# EAGLE design servo (EAGLE 9.6.2)
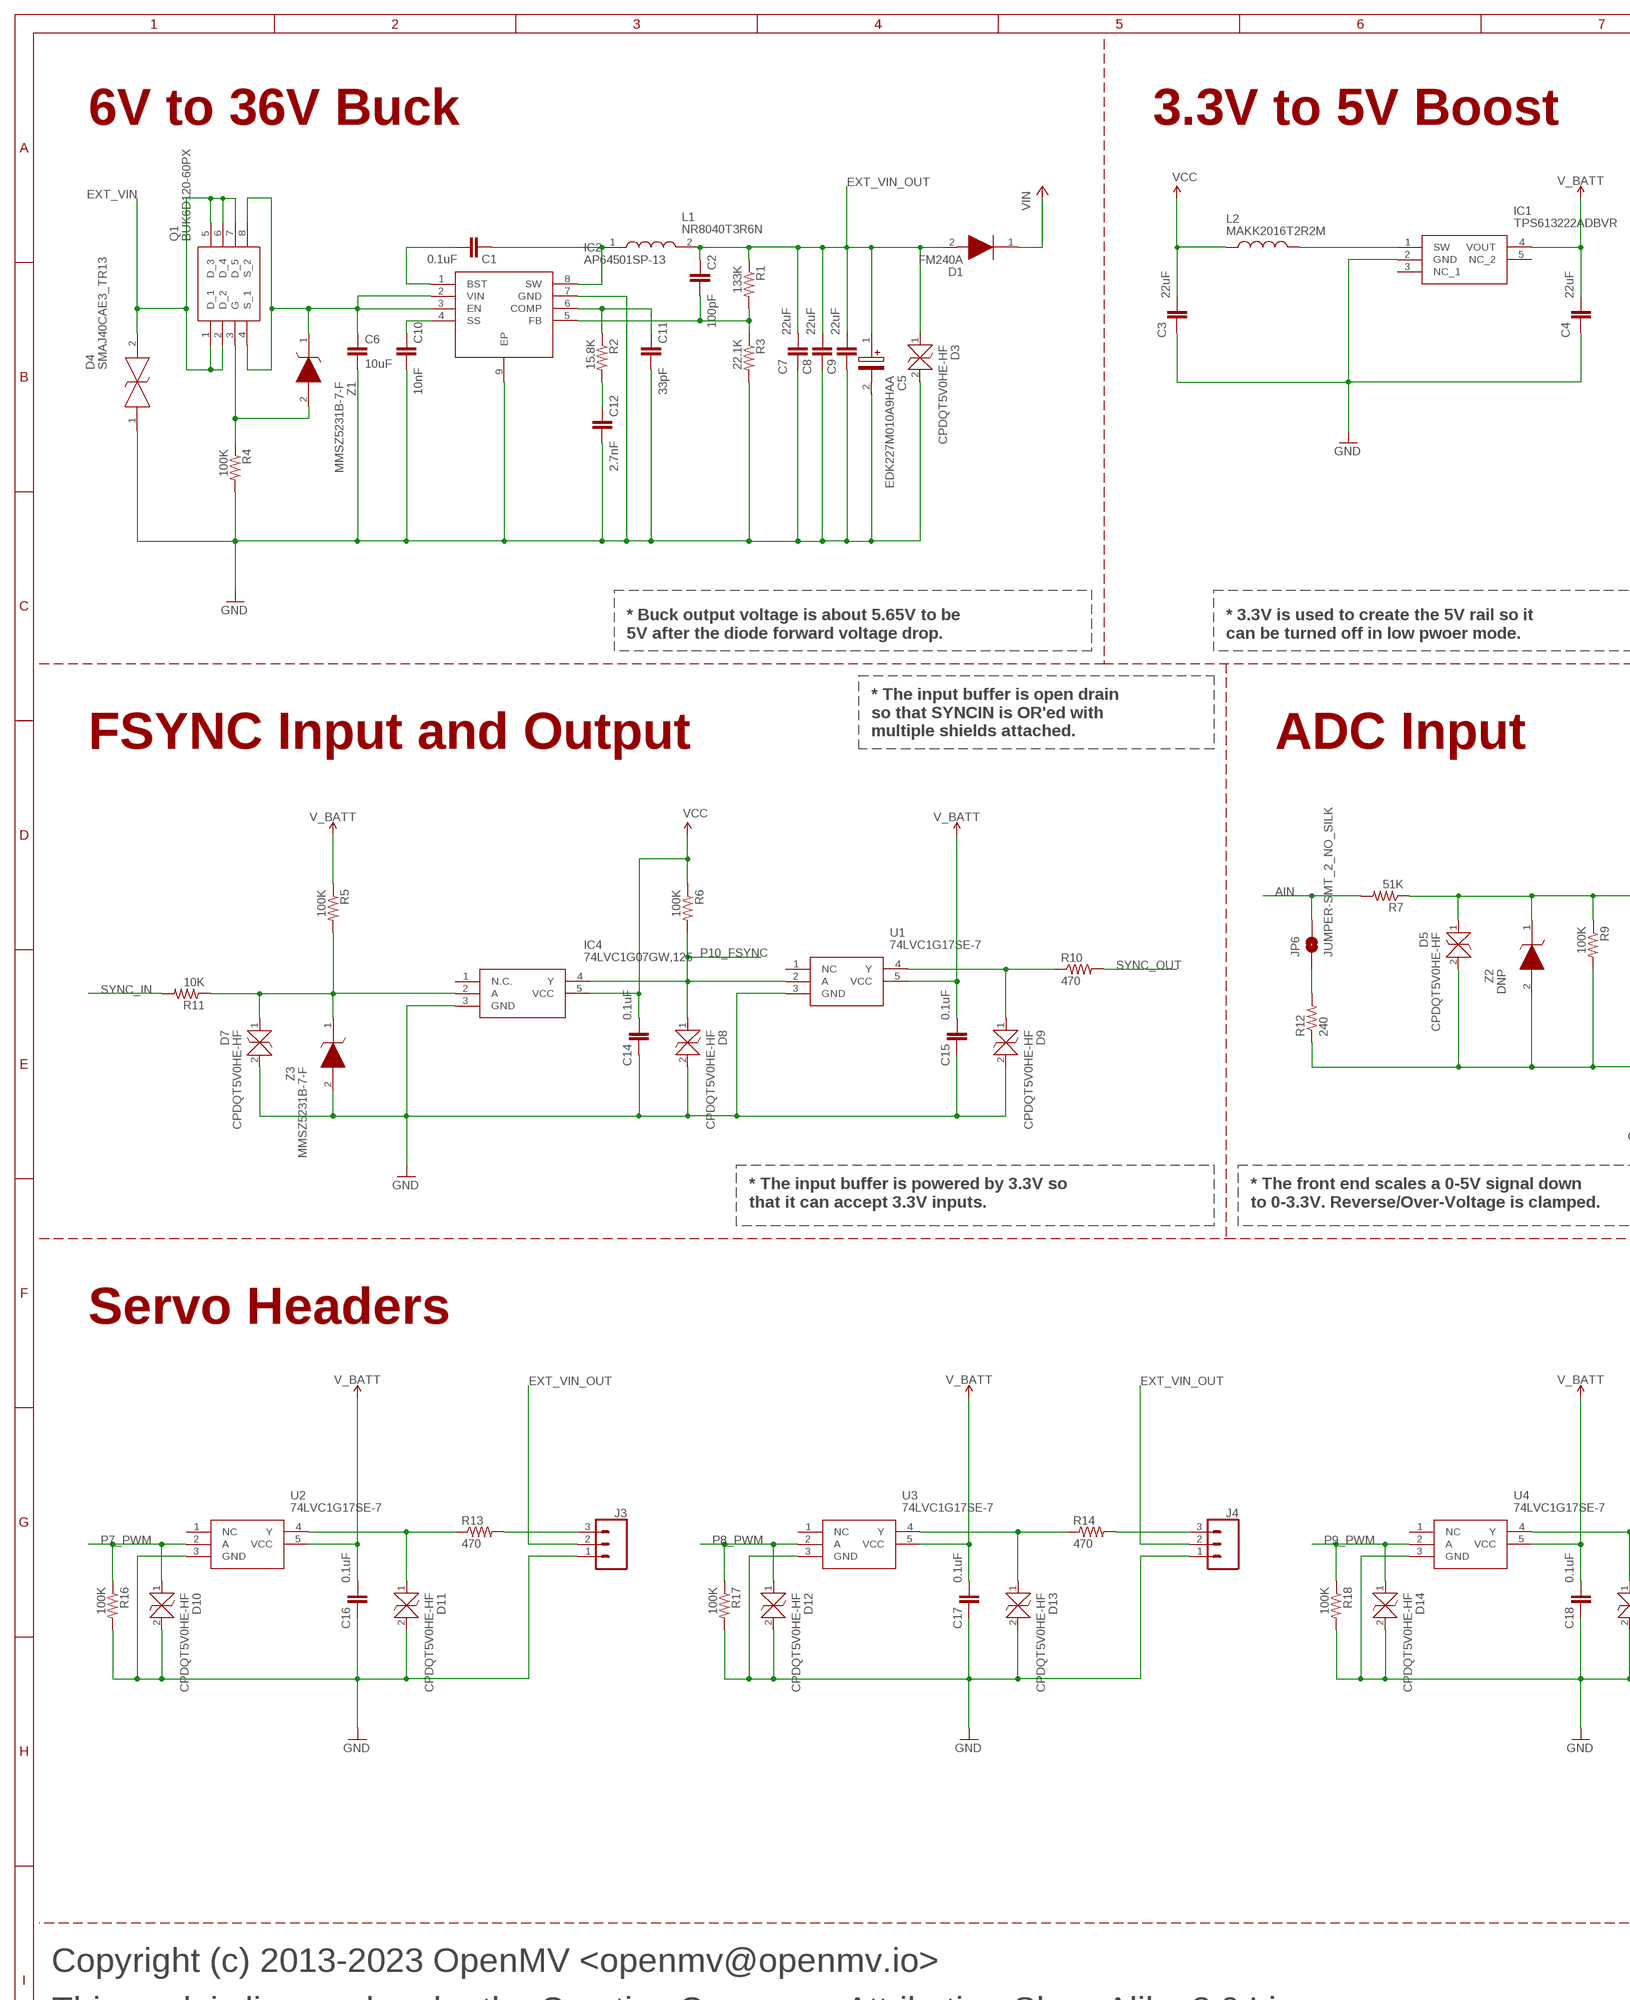
[diagram p0: schematic, sheet 1, part 1 of 2]
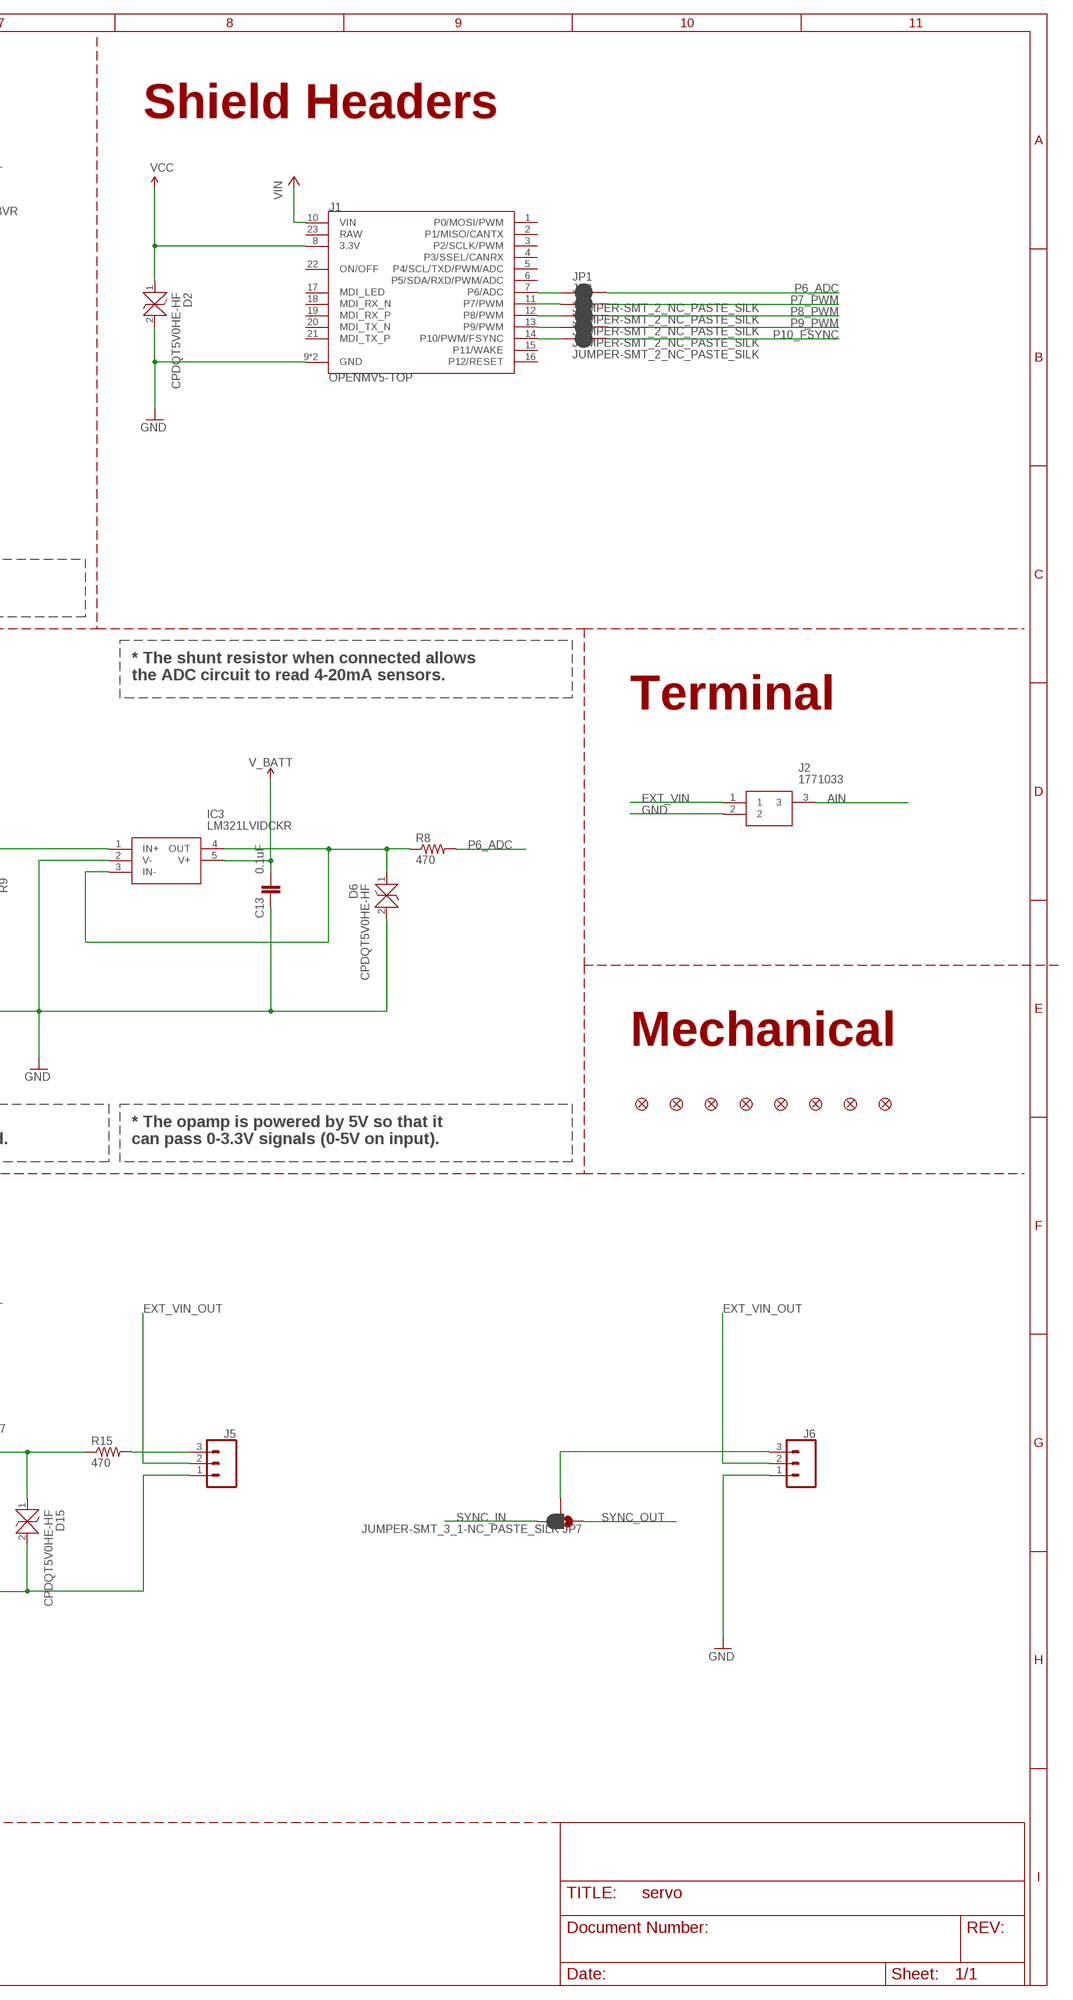
[diagram p1: schematic, sheet 1, part 2 of 2]

## Parts
C1  0.1uF  CAP_0402  [0402]
C2  100pF  CAP_0402  [0402]
C3  22uF  22UF-0805-6.3V-20%  [0805]
C4  22uF  22UF-0805-6.3V-20%  [0805]
C5  EDK227M010A9HAA  [CAPAE660X800N]
C6  10uF  C-EUC0805  [C0805]
C7  22uF  22UF-0805-6.3V-20%  [0805]
C8  22uF  22UF-0805-6.3V-20%  [0805]
C9  22uF  22UF-0805-6.3V-20%  [0805]
C10  10nF  CAP_0402  [0402]
C11  33pF  CAP_0402  [0402]
C12  2.7nF  CAP_0402  [0402]
C13  0.1uF  CAP_0402  [0402]
C14  0.1uF  CAP_0402  [0402]
C15  0.1uF  CAP_0402  [0402]
C16  0.1uF  CAP_0402  [0402]
C17  0.1uF  CAP_0402  [0402]
C18  0.1uF  CAP_0402  [0402]
D1  FM240A  [DIOM5025X231N]
D2  CPDQT5V0HE-HF  [CPDQT5V0HEHF]
D3  CPDQT5V0HE-HF  [CPDQT5V0HEHF]
D4  SMAJ40CAE3_TR13  [SMAJ40CAE3TR13]
D5  CPDQT5V0HE-HF  [CPDQT5V0HEHF]
D6  CPDQT5V0HE-HF  [CPDQT5V0HEHF]
D7  CPDQT5V0HE-HF  [CPDQT5V0HEHF]
D8  CPDQT5V0HE-HF  [CPDQT5V0HEHF]
D9  CPDQT5V0HE-HF  [CPDQT5V0HEHF]
D10  CPDQT5V0HE-HF  [CPDQT5V0HEHF]
D11  CPDQT5V0HE-HF  [CPDQT5V0HEHF]
D12  CPDQT5V0HE-HF  [CPDQT5V0HEHF]
D13  CPDQT5V0HE-HF  [CPDQT5V0HEHF]
D14  CPDQT5V0HE-HF  [CPDQT5V0HEHF]
D15  CPDQT5V0HE-HF  [CPDQT5V0HEHF]
FD1  FIDUCIAL1X2  [FIDUCIAL-1X2]
FD2  FIDUCIAL1X2  [FIDUCIAL-1X2]
FD3  FIDUCIAL1X2  [FIDUCIAL-1X2]
FD4  FIDUCIAL1X2  [FIDUCIAL-1X2]
FD5  FIDUCIAL1X2  [FIDUCIAL-1X2]
FD6  FIDUCIAL1X2  [FIDUCIAL-1X2]
FD7  FIDUCIAL1X2  [FIDUCIAL-1X2]
FD8  FIDUCIAL1X2  [FIDUCIAL-1X2]
IC1  TPS613222ADBVR  [SOT95P280X145-5N]
IC2  AP64501SP-13  [SOIC127P600X163-9N]
IC3  LM321LVIDCKR  [SOT65P210X110-5N]
IC4  74LVC1G07GW,125  [SOT65P212X110-5N]
J1  OPENMV5-TOP  [OPENMV5-TOP]
J2  1771033  [1771033]
J3  CONN_03  [1X03]
J4  CONN_03  [1X03]
J5  CONN_03  [1X03]
J6  CONN_03  [1X03]
JP1  JUMPER-SMT_2_NC_PASTE_SILK  [SMT-JUMPER_2_NC_PASTE_SILK]
JP2  JUMPER-SMT_2_NC_PASTE_SILK  [SMT-JUMPER_2_NC_PASTE_SILK]
JP3  JUMPER-SMT_2_NC_PASTE_SILK  [SMT-JUMPER_2_NC_PASTE_SILK]
JP4  JUMPER-SMT_2_NC_PASTE_SILK  [SMT-JUMPER_2_NC_PASTE_SILK]
JP5  JUMPER-SMT_2_NC_PASTE_SILK  [SMT-JUMPER_2_NC_PASTE_SILK]
JP6  JUMPER-SMT_2_NO_SILK  [SMT-JUMPER_2_NO_SILK]
JP7  JUMPER-SMT_3_1-NC_PASTE_SILK  [SMT-JUMPER_3_1-NC_PASTE_SILK]
L1  NR8040T3R6N  [NR8040T3R6N]
L2  MAKK2016T2R2M  [INDC2016X100N]
Q1  BUK6D120-60PX  [BUK6D12060PX]
R1  133K  RES_0402  [0402]
R2  15.8K  RES_0402  [0402]
R3  22.1K  RES_0402  [0402]
R4  100K  RES_0402  [0402]
R5  100K  RES_0402  [0402]
R6  100K  RES_0402  [0402]
R7  51K  RES_0402  [0402]
R8  470  R-US_R0603  [R0603]
R9  100K  RES_0402  [0402]
R10  470  R-US_R0603  [R0603]
R11  10K  RES_0402  [0402]
R12  240  R-US_R0603  [R0603]
R13  470  R-US_R0603  [R0603]
R14  470  R-US_R0603  [R0603]
R15  470  R-US_R0603  [R0603]
R16  100K  RES_0402  [0402]
R17  100K  RES_0402  [0402]
R18  100K  RES_0402  [0402]
U1  74LVC1G17SE-7  [SOT65P210X110-5N]
U2  74LVC1G17SE-7  [SOT65P210X110-5N]
U3  74LVC1G17SE-7  [SOT65P210X110-5N]
U4  74LVC1G17SE-7  [SOT65P210X110-5N]
Z1  MMSZ5231B-7-F  [SOD3716X145N]
Z2  DNP  MM3Z3V6T1G  [SOD2512X110N]
Z3  MMSZ5231B-7-F  [SOD3716X145N]

## Nets
AIN [signal]: J2.3 JP6.2 R7.2
AIN_INT [signal]: D5.1 IC3.1(IN+) R7.1 R9.1 Z2.1(K)
AIN_OUT [signal]: D6.1 IC3.3(IN-) IC3.4(OUT) R8.1
AIN_S [signal]: JP6.1 R12.2
EXT_VIN [hipwr]: D4.2 J2.1 Q1.1(D_1) Q1.2(D_2) Q1.5(D_3) Q1.6(D_4) Q1.7(D_5)
EXT_VIN_BST [hipwr]: C1.2 IC2.1(BST)
EXT_VIN_COMP [hipwr]: C11.1 IC2.6(COMP) R2.1
EXT_VIN_COMP_CAP [hipwr]: C12.1 R2.2
EXT_VIN_FB [hipwr]: C2.2 IC2.5(FB) R1.2 R3.1
EXT_VIN_G [hipwr]: Q1.3(G) R4.1 Z1.2(A)
EXT_VIN_INT [hipwr]: C6.1 IC2.2(VIN) IC2.3(EN) Q1.4(S_1) Q1.8(S_2) Z1.1(K)
EXT_VIN_OUT [hipwr]: C2.1 C5.1(+) C7.2 C8.2 C9.2 D1.2(A) D3.1 J3.2 J4.2 J5.2 J6.2 L1.2 R1.1
EXT_VIN_SS [hipwr]: C10.1 IC2.4(SS)
EXT_VIN_SW [hipwr]: C1.1 IC2.8(SW) L1.1
GND [gnd]: C3.1 C4.1 C5.2(-) C6.2 C7.1 C8.1 C9.1 C10.2 C11.2 C12.2 C13.1 C14.1 C15.1 C16.1 C17.1 C18.1 D2.2 D3.2 D4.1 D5.2 D6.2 D7.2 D8.2 D9.2 D10.2 D11.2 D12.2 D13.2 D14.2 D15.2 IC1.2(GND) IC2.7(GND) IC2.9(EP) IC3.2(V-) IC4.3(GND) J1.9(GND) J1.24(GND) J2.2 J3.1 J4.1 J5.1 J6.1 R3.2 R4.2 R9.2 R12.1 R16.2 R17.2 R18.2 U1.3(GND) U2.3(GND) U3.3(GND) U4.3(GND) Z2.2(A) Z3.2(A)
P6_ADC [signal]: JP1.2 R8.2
P6_ADC_INT [signal]: J1.7(P6/ADC) JP1.1
P7_PWM [signal]: D10.1 JP2.2 R16.1 U2.2(A)
P7_PWM_INT [signal]: J1.11(P7/PWM) JP2.1
P7_PWM_SERVO [signal]: J3.3 R13.2
P7_PWM_SERVO_INT [signal]: D11.1 R13.1 U2.4(Y)
P8_PWM [signal]: D12.1 JP3.2 R17.1 U3.2(A)
P8_PWM_INT [signal]: J1.12(P8/PWM) JP3.1
P8_PWM_SERVO [signal]: J4.3 R14.2
P8_PWM_SERVO_INT [signal]: D13.1 R14.1 U3.4(Y)
P9_PWM [signal]: D14.1 JP4.2 R18.1 U4.2(A)
P9_PWM_INT [signal]: J1.13(P9/PWM) JP4.1
P9_PWM_SERVO [signal]: J5.3 R15.2
P9_PWM_SERVO_INT [signal]: D15.1 R15.1 U4.4(Y)
P10_FSYNC [signal]: D8.1 IC4.4(Y) JP5.2 R6.2 U1.2(A)
P10_FSYNC_INT [signal]: J1.14(P10/PWM/FSYNC) JP5.1
SW [hipwr]: IC1.1(SW) L2.2
SYNC [signal]: J6.3 JP7.2
SYNC_IN [signal]: JP7.3 R11.2
SYNC_IN_INT [signal]: D7.1 IC4.2(A) R5.2 R11.1 Z3.1(K)
SYNC_OUT [signal]: JP7.1 R10.2
SYNC_OUT_INT [signal]: D9.1 R10.1 U1.4(Y)
V_BATT [pwr]: C4.2 C13.2 C15.2 C16.2 C17.2 C18.2 IC1.4(VOUT) IC3.5(V+) R5.1 U1.5(VCC) U2.5(VCC) U3.5(VCC) U4.5(VCC)
VCC [pwr]: C3.2 C14.2 D2.1 IC4.5(VCC) J1.8(3.3V) L2.1 R6.1
VIN [hipwr]: D1.1(K) J1.10(VIN)
Unconnected: IC1.3(NC_1) IC1.5(NC_2) IC4.1(N.C.) J1.1(P0/MOSI/PWM) J1.2(P1/MISO/CANTX) J1.3(P2/SCLK/PWM) J1.4(P3/SSEL/CANRX) J1.5(P4/SCL/TXD/PWM/ADC) J1.6(P5/SDA/RXD/PWM/ADC) J1.15(P11/WAKE) J1.16(P12/RESET) J1.17(MDI_LED) J1.18(MDI_RX_N) J1.19(MDI_RX_P) J1.20(MDI_TX_N) J1.21(MDI_TX_P) J1.22(ON/OFF) J1.23(RAW) U1.1(NC) U2.1(NC) U3.1(NC) U4.1(NC)

## Notes on the sheet
- 6V to 36V Buck | 3.3V to 5V Boost | Shield Headers
- * Buck output voltage is about 5.65V to be
  5V after the diode forward voltage drop.
- * 3.3V is used to create the 5V rail so it
  can be turned off in low pwoer mode.
- * The shunt resistor when connected allows
  the ADC circuit to read 4-20mA sensors.
- * The input buffer is open drain
  so that SYNCIN is OR'ed with
  multiple shields attached.
- FSYNC Input and Output | ADC Input | Terminal
- Mechanical
- * The input buffer is powered by 3.3V so
  that it can accept 3.3V inputs.
- * The front end scales a 0-5V signal down
  to 0-3.3V. Reverse/Over-Voltage is clamped.
- * The opamp is powered by 5V so that it
  can pass 0-3.3V signals (0-5V on input).
- Servo Headers
- Copyright (c) 2013-2023 OpenMV <openmv@openmv.io>
- This work is licensed under the Creative Commons Attribution-ShareAlike 3.0 License.
- To view a copy of this license, visit http://creativecommons.org/licenses/by-sa/3.0/

## Library data of the parts
C1 C13-C18 = 0402:CAP_0402: 0402 (1005 Metric) Nick Garner - TeleSense; MPN: GRM155R71H104KE14D
C2 = 0402:CAP_0402: 0402 (1005 Metric) Nick Garner - TeleSense; MPN: CC0402JRNPO9BN101
C3 C4 C7-C9 = SparkFun-Capacitors:22UF: 22µF ceramic capacitors A capacitor is a passive two-terminal electrical component used to store electrical energy temporarily in an electric field.; MPN: CL21A226MQQNNNE; PROD_ID: CAP-08402
C5 = EDK227M010A9HAA:EDK227M010A9HAA: EDK, Aluminum, Aluminum Electrolytic, 220 uF, 20%, 10 VDC, -40/+85C, 85C, -40C, 85C, 2,000 Hrs, 26 % , 0.25, 22 uA, 3, 6, 6.3mm, 7.7mm, 1000 Source: Datasheet <https://content.kemet.com/datasheets/KEM_A4001_EDK.pdf>; DESCRIPTION: EDK, Aluminum, Aluminum Electrolytic, 220 uF, 20%, 10 VDC, -40/+85C, 85C, -40C, 85C, 2,000 Hrs, 26 % , 0.25, 22 uA, 3, 6, 6.3mm, 7.7mm, 1000; HEIGHT: 8mm; MANUFACTURER_NAME: KEMET; MANUFACTURER_PART_NUMBER: EDK227M010A9HAA; MOUSER_PART_NUMBER: 80-EDK227M010A9HAA; MOUSER_PRICE-STOCK: https://www.mouser.co.uk/ProductDetail/KEMET/EDK227M010A9HAA?qs=E9QF1UCAUX64XuBtcKp6BA%3D%3D; MPN: EDK227M010A9HAA
C6 = rcl:C-EU: CAPACITOR, European symbol; MPN: GRM21BR61H106KE43K; SPICEPREFIX: C
C10 = 0402:CAP_0402: 0402 (1005 Metric) Nick Garner - TeleSense; MPN: CL05B103KB5NNNC
C11 = 0402:CAP_0402: 0402 (1005 Metric) Nick Garner - TeleSense; MPN: 04025A330JAT2A
C12 = 0402:CAP_0402: 0402 (1005 Metric) Nick Garner - TeleSense; MPN: GCM155R71H272KA37J
D1 = FM240A:FM240A: Diodes - General Purpose, Power, Switching GP Si Rectifier SMB,2A,40V Source: Datasheet <https://ms.componentsearchengine.com/Datasheets/1/FM240A.pdf>; DESCRIPTION: Diodes - General Purpose, Power, Switching GP Si Rectifier SMB,2A,40V; HEIGHT: 2.31mm; MANUFACTURER_NAME: Rectron; MANUFACTURER_PART_NUMBER: FM240A; MOUSER_PART_NUMBER: 583-FM240A; MOUSER_PRICE-STOCK: https://www.mouser.co.uk/ProductDetail/Rectron/FM240A?qs=7pEAo90IqNG7sknZwmLYhQ%3D%3D; MPN: FM240A
D2 D3 D5-D15 = CPDQT5V0HE-HF:CPDQT5V0HE-HF: ESD Suppressors / TVS Diodes DIODE ESD 5VWM 65W 0402/SOD-923F Source: Datasheet <https://www.comchiptech.com/admin/files/product/CPDQT5V0HE-HF RevA.PDF>; DESCRIPTION: ESD Suppressors / TVS Diodes DIODE ESD 5VWM 65W 0402/SOD-923F; HEIGHT: 0.42mm; MANUFACTURER_NAME: Comchip Technology; MANUFACTURER_PART_NUMBER: CPDQT5V0HE-HF; MPN: CPDQT5V0HE-HF
D4 = SMAJ40CAe3_TR13:SMAJ40CAE3_TR13: ESD Suppressors / TVS Diodes TVS Source: Datasheet <https://www.arrow.com/en/products/smaj40cae3tr13/microchip-technology?region=nac>; DESCRIPTION: ESD Suppressors / TVS Diodes TVS; HEIGHT: 3.05mm; MANUFACTURER_NAME: Microchip; MANUFACTURER_PART_NUMBER: SMAJ40CAe3/TR13; MOUSER_PART_NUMBER: 494-SMAJ40CAE3/TR13; MOUSER_PRICE-STOCK: https://www.mouser.co.uk/ProductDetail/Microchip-Technology/SMAJ40CAe3-TR13?qs=pU29NIZ4ZwCw3PnlxOleOw%3D%3D; MPN: SMAJ40CAe3/TR13
FD1-FD8 = SparkFun-Aesthetics:FIDUCIAL: Fiducial Alignment Points Point-of-reference for pick-and-place machines and other optical instruments.
IC1 = TPS613222ADBVR:TPS613222ADBVR: 6-uA Quiescent Current, 1.8-A Switch Current Boost Converter Source: Datasheet <http://www.ti.com/lit/gpn/tps61322>; DESCRIPTION: 6-uA Quiescent Current, 1.8-A Switch Current Boost Converter; HEIGHT: 1.45mm; MANUFACTURER_NAME: Texas Instruments; MANUFACTURER_PART_NUMBER: TPS613222ADBVR; MOUSER_PART_NUMBER: 595-TPS613222ADBVR; MOUSER_PRICE-STOCK: https://www.mouser.co.uk/ProductDetail/Texas-Instruments/TPS613222ADBVR?qs=W0yvOO0ixfE4d69WXsn8NQ%3D%3D; MPN: TPS613222ADBVR
IC2 = AP64501SP-13:AP64501SP-13: Conv DC-DC 3.8V to 40V Synchronous Step Down Single-Out 0.8V to 39V 5A 8-Pin SO EP T/R Source: Datasheet <https://www.arrow.com/en/products/ap64501sp-13/diodes-incorporated>; DESCRIPTION: Conv DC-DC 3.8V to 40V Synchronous Step Down Single-Out 0.8V to 39V 5A 8-Pin SO EP T/R; HEIGHT: 1.63mm; MANUFACTURER_NAME: Diodes Inc.; MANUFACTURER_PART_NUMBER: AP64501SP-13; MOUSER_PART_NUMBER: 621-AP64501SP-13; MOUSER_PRICE-STOCK: https://www.mouser.co.uk/ProductDetail/Diodes-Incorporated/AP64501SP-13?qs=P1JMDcb91o7FS0GU%252BW7TIQ%3D%3D; MPN: AP64501SP-13
IC3 = LM321LVIDCKR:LM321LVIDCKR: 1-Channel industry standard low voltage operational amplifier Source: Datasheet <http://www.ti.com/lit/gpn/LM321LV>; DESCRIPTION: 1-Channel industry standard low voltage operational amplifier; HEIGHT: 1.1mm; MANUFACTURER_NAME: Texas Instruments; MANUFACTURER_PART_NUMBER: LM321LVIDCKR; MOUSER_PART_NUMBER: 595-LM321LVIDCKR; MOUSER_PRICE-STOCK: https://www.mouser.co.uk/ProductDetail/Texas-Instruments/LM321LVIDCKR?qs=qSfuJ%252Bfl%2Fd6RcyTOjkRx5Q%3D%3D; MPN: LM321LVIDCKR
IC4 = 74LVC1G07GW_125:74LVC1G07GW,125: 74LVC1G07 - Buffer with open-drain output@en-us Source: Datasheet <https://assets.nexperia.com/documents/data-sheet/74LVC1G07.pdf>; DESCRIPTION: 74LVC1G07 - Buffer with open-drain output@en-us; HEIGHT: 1.1mm; MANUFACTURER_NAME: Nexperia; MANUFACTURER_PART_NUMBER: 74LVC1G07GW,125; MOUSER_PART_NUMBER: 771-74LVC1G07GW-G; MOUSER_PRICE-STOCK: https://www.mouser.co.uk/ProductDetail/Nexperia/74LVC1G07GW125?qs=me8TqzrmIYW763Mg%2FG86Uw%3D%3D; MPN: 74LVC1G07GW,125
J1 = openmv5:OPENMV5-TOP
J2 = 1771033:1771033: PCB terminal block, nominal current: 6 A, rated voltage (III/2): 160 V, nominal cross section: 0.5 mm?, Number of potentials: 3, Number of rows: 1, Number of positions per row: 3, product range: PTSM 0,5/..-H-SMD, pitch: 2.5 mm, connection method: Push-in spring connection, mounting: SMD soldering, conductor/PCB connection direction: 0 ?, color: black, Pin layout: Linear pad geometry, type of packaging: packed in cardboard Source: Datasheet <http://www.phoenixcontact.com/de/produkte/1771033/pdf>; ARROW_PART_NUMBER: 1771033; ARROW_PRICE-STOCK: https://www.arrow.com/en/products/1771033/phoenix-contact?region=nac; DESCRIPTION: PCB terminal block, nominal current: 6 A, rated voltage (III/2): 160 V, nominal cross section: 0.5 mm?, Number of potentials: 3, Number of rows: 1, Number of positions per row: 3, product range: PTSM 0,5/..-H-SMD, pitch: 2.5 mm, connection method: Push-in spring connection, mounting: SMD soldering, conductor/PCB connection direction: 0 ?, color: black, Pin layout: Linear pad geometry, type of packaging: packed in cardboard; HEIGHT: 5.22mm; MANUFACTURER_NAME: Phoenix Contact; MANUFACTURER_PART_NUMBER: 1771033; MOUSER_PART_NUMBER: 651-1771033; MOUSER_PRICE-STOCK: https://www.mouser.co.uk/ProductDetail/Phoenix-Contact/1771033?qs=Q77YN%2FRrsKK5q5FqaCIZZA%3D%3D; MPN: 1771033
J3-J6 = SparkFun-Connectors:CONN_03: Multi connection point. Often used as Generic Header-pin footprint for 0.1 inch spaced/style header connections On any of the 0.1 inch spaced packages, you can populate with these: Break Away Headers - Straight <https://www.sparkfun.com/products/116> (PRT-00116) Break Away Male Headers - Right Angle <https://www.sparkfun.com/products/553> (PRT-00553) Female Headers <https://www.sparkfun.com/products/115> (PRT-00115) Break Away Headers - Machine Pin <https://www.sparkfun.com/products/117> (PRT-00117) Break Away Female Headers - Swiss Machine Pin <https://www.sparkfun.com/products/743> (PRT-00743) Stackable Header - 3 Pin (Female, 0.1") <https://www.sparkfun.com/products/13875> (PRT-13875) For SCREWTERMINALS and SPRING TERMINALS visit here: Screw Terimnals on SparkFun.com <https://www.sparkfun.com/search/results?term=Screw+Terminals> (5mm/3.5mm/2.54mm spacing) This device is also useful as a general connection point to wire up your design to another part of your project. Our various solder wires solder well into these plated through hole pads. Hook-Up Wire - Assortment (Stranded, 22 AWG) <https://www.sparkfun.com/products/11375> (PRT-11375) Hook-Up Wire - Assortment (Solid Core, 22 AWG) <https://www.sparkfun.com/products/11367> (PRT-11367) View the entire wire category on our website here <https://www.sparkfun.com/categories/141> Special notes: Molex polarized connector foot print use with SKU : PRT-08232 with associated crimp pins and housings.
JP1-JP5 = SparkFun-Jumpers:JUMPER-SMT_2_NC_PASTE: Normally closed solder jumper This jumper has an aperture in the stencil to allow solder paste to bridge the split in the wire so it's normally closed (NC). Wick off the solder to open the connection. Reapply solder to reclose the connection.
JP6 = SparkFun-Jumpers:JUMPER-SMT_2_NO: Normally open jumper This jumper has two pads in close proximity to each other. Apply solder to close the connection. Round pads are easier to solder for beginners, but are a lot larger. SparkFun Product that uses the round pads: SparkFun EL Sequencer <https://www.sparkfun.com/products/12781>
JP7 = SparkFun-Jumpers:JUMPER-SMT_3_1-NC_PASTE: Normally closed solder jumper (1 of 2 connections) This jumper has an aperture in the stencil to allow solder paste to bridge one of the two connections. One connection is normally closed (NC), while the other is normally open (NO). Wick off the solder to open the connection. Reapply solder to reclose the connection. Apply solder to the other side instead to change the current path.
L1 = NR8040T3R6N:NR8040T3R6N: NR8040T3R6N Source: Datasheet <https://componentsearchengine.com/Datasheets/1/NR8040T3R6N.pdf>; DESCRIPTION: NR8040T3R6N; HEIGHT: 4.2mm; MANUFACTURER_NAME: TAIYO YUDEN; MANUFACTURER_PART_NUMBER: NR8040T3R6N; MOUSER_PART_NUMBER: 963-NR8040T3R6N; MOUSER_PRICE-STOCK: https://www.mouser.co.uk/ProductDetail/Taiyo-Yuden/NR8040T3R6N?qs=PzICbMaShUfIZ5Ej1bVWkg%3D%3D; MPN: NRS8040T3R6NJGJ
L2 = MAKK2016T2R2M:MAKK2016T2R2M: INDUCTOR, METAL CORE Check availability <https://pricing.snapeda.com/parts/MAKK2016T2R2M/Taiyo%20Yuden/view-part?ref=eda>; AVAILABILITY: In Stock; DESCRIPTION: 2.2 µH Shielded Drum Core, Wirewound Inductor 1.5 A 160mOhm Max 0806 (2016 Metric); MF: Taiyo Yuden; MP: MAKK2016T2R2M; MPN: MAKK2016T2R2M; PACKAGE: 2016 Taiyo Yuden; PRICE: None; PURCHASE-URL: https://pricing.snapeda.com/search/part/MAKK2016T2R2M/?ref=eda
Q1 = BUK6D120-60PX:BUK6D120-60PX: MOSFET 60V P-CH TRENCHMOS SOT1220 Source: Datasheet <https://componentsearchengine.com/Datasheets/2/BUK6D120-60PX.pdf>; DESCRIPTION: MOSFET 60V P-CH TRENCHMOS SOT1220; HEIGHT: 0.65mm; MANUFACTURER_NAME: Nexperia; MANUFACTURER_PART_NUMBER: BUK6D120-60PX; MOUSER_PART_NUMBER: 771-BUK6D120-60PX; MOUSER_PRICE-STOCK: https://www.mouser.co.uk/ProductDetail/Nexperia/BUK6D120-60PX?qs=F5EMLAvA7IBtoNC2L3hOcQ%3D%3D; MPN: BUK6D120-60PX
R1 = 0402:RES_0402: 0402 (1005 Metric) Nick Garner - TeleSense; MPN: RC0402FR-07133KL
R2 = 0402:RES_0402: 0402 (1005 Metric) Nick Garner - TeleSense; MPN: AC0402FR-0715K8L
R3 = 0402:RES_0402: 0402 (1005 Metric) Nick Garner - TeleSense; MPN: CR0402-FX-2212GLF
R4-R6 R9 R16-R18 = 0402:RES_0402: 0402 (1005 Metric) Nick Garner - TeleSense; MPN: AC0402FR-07100KL
R7 = 0402:RES_0402: 0402 (1005 Metric) Nick Garner - TeleSense; MPN: RC0402JR-0751KL
R8 R10 R13-R15 = rcl:R-US_: RESISTOR, American symbol; MPN: CR0603-FX-4700ELF; SPICEPREFIX: R
R11 = 0402:RES_0402: 0402 (1005 Metric) Nick Garner - TeleSense; MPN: AC0402FR-1310KL
R12 = rcl:R-US_: RESISTOR, American symbol; MPN: RK73B1JTTD241J; SPICEPREFIX: R
U1-U4 = 74LVC1G17SE-7:74LVC1G17SE-7: DiodesZetex 74LVC1G17SE-7, Buffer, Push-Pull, Non-Inverting, 1.65 5.5 V, 5-Pin SOT-353 Source: Datasheet <https://componentsearchengine.com/Datasheets/2/74LVC1G17SE-7.pdf>; DESCRIPTION: DiodesZetex 74LVC1G17SE-7, Buffer, Push-Pull, Non-Inverting, 1.65 5.5 V, 5-Pin SOT-353; HEIGHT: 1.1mm; MANUFACTURER_NAME: Diodes Inc.; MANUFACTURER_PART_NUMBER: 74LVC1G17SE-7; MOUSER_PART_NUMBER: 621-74LVC1G17SE-7; MOUSER_PRICE-STOCK: https://www.mouser.co.uk/ProductDetail/Diodes-Incorporated/74LVC1G17SE-7?qs=FRHfhEBFk1dzIcstjqNcyA%3D%3D; MPN: 74LVC1G17SE-7
Z1 Z3 = MMSZ5231B-7-F:MMSZ5231B-7-F: Zener Diode 5.1V 5% 500mW SOD123 Diodes Inc MMSZ5231B-7-F Zener Diode, 5.1V 5% 0.5 W SMT 2-Pin SOD-123 Source: Datasheet <https://www.diodes.com/assets/Datasheets/ds18010.pdf>; DESCRIPTION: Zener Diode 5.1V 5% 500mW SOD123 Diodes Inc MMSZ5231B-7-F Zener Diode, 5.1V 5% 0.5 W SMT 2-Pin SOD-123; HEIGHT: 1.45mm; MANUFACTURER_NAME: Diodes Inc.; MANUFACTURER_PART_NUMBER: MMSZ5231B-7-F; MOUSER_PART_NUMBER: 621-MMSZ5231B-F; MOUSER_PRICE-STOCK: https://www.mouser.co.uk/ProductDetail/Diodes-Incorporated/MMSZ5231B-7-F?qs=2ygBApjwyeMh7Sf0YL1qSw%3D%3D; MPN: MMSZ5231B-7-F
Z2 = MM3Z3V6T1G:MM3Z3V6T1G: ON Semiconductor MM3Z3V6T1G Zener Diode, 3.6V 5% 200 mW SMT 2-Pin SOD-323 Source: Datasheet <http://www.onsemi.com/pub/Collateral/MM3Z2V4T1-D.PDF>; DESCRIPTION: ON Semiconductor MM3Z3V6T1G Zener Diode, 3.6V 5% 200 mW SMT 2-Pin SOD-323; HEIGHT: 1.1mm; MANUFACTURER_NAME: onsemi; MANUFACTURER_PART_NUMBER: MM3Z3V6T1G; MOUSER_PART_NUMBER: 863-MM3Z3V6T1G; MOUSER_PRICE-STOCK: https://www.mouser.co.uk/ProductDetail/onsemi/MM3Z3V6T1G?qs=HVbQlW5zcXWbZo78nv8gqg%3D%3D; MPN: MM3Z3V6T1G; POPULATE: 0

## Net classes
0 default: width 0.127 mm, drill 0.254 mm, clearance 0.127 mm
2 gnd: width 0.127 mm, drill 0.254 mm, clearance 0.127 mm to class 0, clearance 0.127 mm to class 1, clearance 0.127 mm
3 pwr: width 0.127 mm, drill 0.254 mm, clearance 0.127 mm to class 0, clearance 0.127 mm to class 1, clearance 0.127 mm to class 2, clearance 0.127 mm
4 signal: width 0.127 mm, drill 0.254 mm, clearance 0.127 mm to class 0, clearance 0.127 mm to class 1, clearance 0.127 mm to class 2, clearance 0.127 mm to class 3, clearance 0.127 mm
6 hipwr: width 0.127 mm, drill 0.254 mm, clearance 0.127 mm to class 0, clearance 0.127 mm to class 1, clearance 0.127 mm to class 2, clearance 0.127 mm to class 3, clearance 0.127 mm to class 4, clearance 0.127 mm to class 5, clearance 0.254 mm

## Board
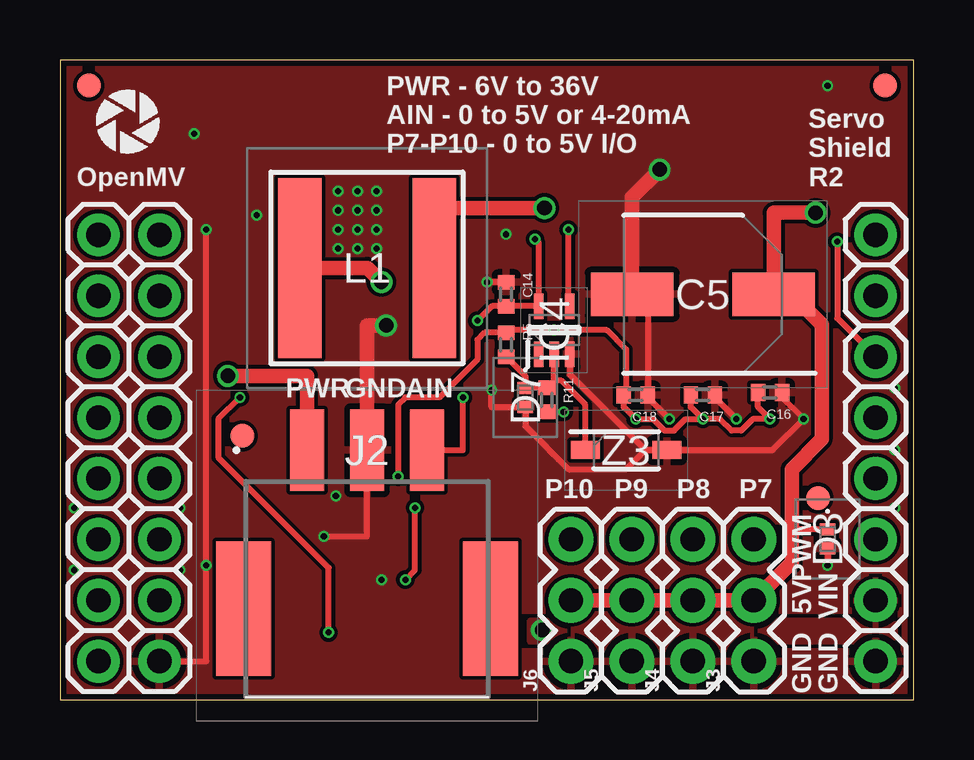
[diagram p2: board, top side]
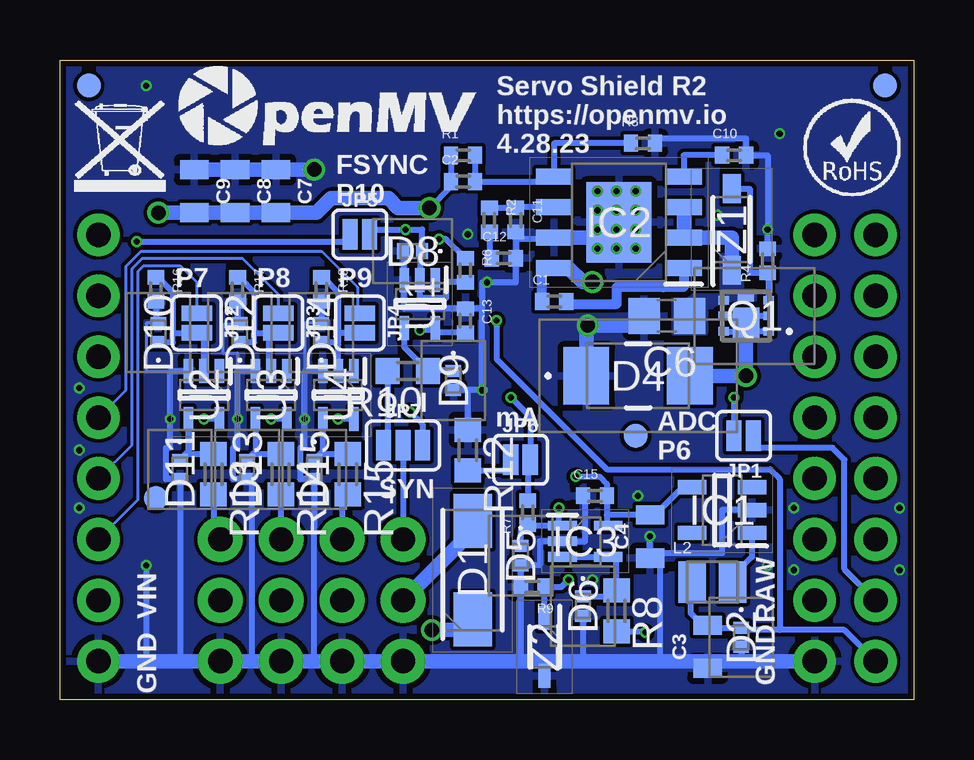
[diagram p3: board, bottom side, seen from below]

Size 35.6 x 26.67 mm. Coordinates in mm from the lower left corner, seen from the top.
Outline: 0,0 35.6,0 35.6,26.67 0,26.67 0,0
Copper layers (1*16): Top 0.035mm / dielectric 1.5mm / Bottom 0.035mm
Design rules "MF_Standard_2_Layer *": minimum track width 5mil, minimum drill 10mil, track to track 5mil, track to pad 5mil, pad to pad 5mil, via to via 5mil, smd to smd 0mil, copper to edge 10mil, drill to drill 10mil, minimum pad ring 4mil, minimum via ring 4mil, stop-mask expansion 2mil, vias tented up to drill 25mil, thermal gap 10mil

### Footprints (pad centres in the part's own frame; a part is rotated, then mirrored left to right if it is on the bottom)
0402 = smd 0.6 x 0.7: 1 -0.5,0; 2 0.5,0
0805 = smd 0.8 x 1.2: 1 -0.9,0; 2 0.9,0
CAPAE660X800N = smd 3.45 x 1.8: 1 -2.95,0; 2 2.95,0
C0805 = smd 1.3 x 1.5: 1 -0.95,0; 2 0.95,0
DIOM5025X231N = smd 2.25 x 1.6: 1 -2.05,0; 2 2.05,0
CPDQT5V0HEHF = smd 0.5 x 0.65: 1 -0.4,0; 2 0.4,0
SMAJ40CAE3TR13 = smd 1.9 x 2.39: 1 -2.16,0; 2 2.16,0
FIDUCIAL-1X2 = smd 1 x 1: 1 0,0
SOT95P280X145-5N = smd 1.2 x 0.6: 1 -1.25,0.95; 2 -1.25,0; 3 -1.25,-0.95; 4 1.25,-0.95; 5 1.25,0.95
SOIC127P600X163-9N = smd 1.5 x 0.65: 1 -2.7,1.905; 2 -2.7,0.635; 3 -2.7,-0.635; 4 -2.7,-1.905; 5 2.7,-1.905; 6 2.7,-0.635; 7 2.7,0.635; 8 2.7,1.905 | smd 2.71 x 3.35: 9 0,0
SOT65P210X110-5N = smd 1.2 x 0.4: 1 -0.95,0.65; 2 -0.95,0; 3 -0.95,-0.65; 4 0.95,-0.65; 5 0.95,0.65
SOT65P212X110-5N = smd 1.05 x 0.4: 1 -1,0.65; 2 -1,0; 3 -1,-0.65; 4 1,-0.65; 5 1,0.65
OPENMV5-TOP = drill 1.016 pad 1.778: 1 1.6,19.38; 2 1.6,16.84; 3 1.6,14.3; 4 1.6,11.76; 5 1.6,9.22; 6 1.6,6.68; 7 1.6,4.14; 8 1.6,1.6; 9 34,1.6; 10 34,4.14; 11 34,6.68; 12 34,9.22; 13 34,11.76; 14 34,14.3; 15 34,16.84; 16 34,19.38; 17 4.14,19.38; 18 4.14,16.84; 19 4.14,14.3; 20 4.14,11.76; 21 4.14,9.22; 22 4.14,6.68; 23 4.14,4.14; 24 4.14,1.6
1771033 = smd 1.4 x 3.4: 1 -2.5,0; 2 0,0; 3 2.5,0 | smd 2.3 x 5.6: 4 -5.15,-6.6; 5 5.15,-6.6
1X03 = drill 1.016 pad 1.88: 1 0,0; 2 2.54,0; 3 5.08,0
SMT-JUMPER_2_NC_PASTE_SILK = smd 0.635 x 1.27: 1 -0.406,0; 2 0.406,0
SMT-JUMPER_2_NO_SILK = smd 0.635 x 1.27: 1 -0.406,0; 2 0.406,0
SMT-JUMPER_3_1-NC_PASTE_SILK = smd 0.635 x 1.27: 1 -0.813,0; 2 0,0; 3 0.813,0
NR8040T3R6N = smd 1.8 x 7.5: 1 -2.8,0; 2 2.8,0
INDC2016X100N = smd 1.14 x 1.73: 1 -0.847,0; 2 0.847,0
BUK6D12060PX = smd 0.43 x 0.35: 1 0.935,-0.65; 2 0.935,0; 3 0.935,0.65; 4 -0.935,0.65; 5 -0.935,0; 6 -0.935,-0.65 | smd 1.1 x 1.25: 7 0,-0.285 | smd 0.66 x 0.35: 8 0,0.775
R0603 = smd 1 x 1.1: 1 -0.85,0; 2 0.85,0
SOT65P210X110-5N' = smd 1 x 0.4: 1 -1,0.65; 2 -1,0; 3 -1,-0.65; 4 1,-0.65; 5 1,0.65
SOD3716X145N = smd 1.2 x 0.75: 1 -1.7,0; 2 1.7,0
SOD2512X110N = smd 1 x 0.5: 1 -1.2,0; 2 1.2,0

### Placement (x,y rotation side)
C1  15,16.6 0 bottom
C2  18.8,21.6 0 bottom
C3  8.6,2.2 90 bottom
C4  11,6.8 90 bottom
C5  26.8,16.9 180 top
C6  10.3,16 180 bottom
C7  26.6,21.2 270 bottom
C8  28.3,21.2 270 bottom
C9  30,21.2 270 bottom
C10  7.5,22.7 0 bottom
C11  16.6,20 270 bottom
C12  17.1,18.4 0 bottom
C13  18.7,15.8 270 bottom
C14  18.6,16.9 270 top
C15  13.3,8.5 0 bottom
C16  29.6,12.8 180 top
C17  26.8,12.7 180 top
C18  24,12.7 180 top
D1  18.4,5.4 90 bottom
D2  7.2,2.6 270 bottom
D3  32,6.7 270 top
D4  11.5,13.5 0 bottom
D5  16.4,6 270 bottom
D6  13.8,3.9 270 bottom
D7  19.4,12.6 270 top
D8  20.9,18.7 180 bottom
D9  19.2,13.3 270 bottom
D10  31.5,15.3 90 bottom
D11  30.6,9.6 270 bottom
D12  28.1,15.3 90 bottom
D13  27.8,9.6 270 bottom
D14  24.7,15.3 90 bottom
D15  25,9.6 270 bottom
FD1  31.6,8.4 0 top
FD2  31.6,8.4 0 bottom
FD3  7.6,11 0 top
FD4  11.6,11 0 bottom
FD5  34.4,25.6 0 top
FD6  34.4,25.6 0 bottom
FD7  1.2,25.6 0 top
FD8  1.2,25.6 0 bottom
IC1  8,7.9 180 bottom
IC2  12.3,19.9 180 bottom
IC3  13.7,6.6 0 bottom
IC4  20.6,15.4 90 top
J1  0,0 0 top
J2  12.8,10.4 0 top
J3  28.92,1.6 90 top
J4  26.38,1.6 90 top
J5  23.84,1.6 90 top
J6  21.3,1.6 90 top
JP1  7.1,11 180 bottom
JP2  29.9,15.7 270 bottom
JP3  26.5,15.7 270 bottom
JP4  23.1,15.7 270 bottom
JP5  23.1,19.4 0 bottom
JP6  16.4,10 0 bottom
JP7  21.3,10.6 0 bottom
L1  12.8,18 0 top
L2  8.4,4.9 0 bottom
Q1  7,16 0 bottom
R1  18.8,22.7 0 bottom
R2  17.7,20 270 bottom
R3  11.3,23.2 0 bottom
R4  6.1,18.3 90 bottom
R5  18.6,14.8 270 top
R6  18.7,17.9 270 bottom
R7  16.1,7.8 90 bottom
R8  12.4,3.7 270 bottom
R9  15.9,4.7 180 bottom
R10  21.1,13.7 180 bottom
R11  20.3,12.5 270 top
R12  18.6,10.4 270 bottom
R13  29.2,9.4 270 bottom
R14  26.4,9.4 270 bottom
R15  23.6,9.4 270 bottom
R16  31.6,17.1 270 bottom
R17  28.2,17.1 270 bottom
R18  24.7,17.1 270 bottom
U1  74LVC1G17SE-7  [SOT65P210X110-5N']  20.6,16.5 270 bottom
U2  74LVC1G17SE-7  [SOT65P210X110-5N']  29.6,12.7 270 bottom
U3  74LVC1G17SE-7  [SOT65P210X110-5N']  26.8,12.7 270 bottom
U4  74LVC1G17SE-7  [SOT65P210X110-5N']  24,12.7 270 bottom
U$1  [WEEE]  35,21.2 0 bottom
U$2  [ROHS]  4.6,21 0 bottom
U$3  [OMV-LOGO]  30.8,22.9 0 bottom
U$9  OPENMV-LOGO  [OPENMV-LOGO]  1.4,22.6 0 top
Z1  7.6,19.6 90 bottom
Z2  15.4,2.2 270 bottom
Z3  23.6,10.4 0 top

### Tracks (layer width: path | path; a pad name or v marks a point on that pad's centre or on a via)
AIN  (via drill 0.25)
  Top 0.254: J2.3 16.8,10.4 v16.8,12.6
  Bottom 0.254: R7.2 16.1,9.89 JP6.2 15.99,11.79 v16.8,12.6
AIN_INT  (via drill 0.25)
  Top 0.254: v14.4,5 14.8,5.4 v14.8,8
  Bottom 0.254: Z2.1 R9.1 14.7,4.7 v14.4,5 | D5.1 16.4,7 R7.1 16.05,7.25 IC3.1 14.8,7.4 v14.8,8
AIN_OUT
  Bottom 0.254: IC3.3 13.2,5.95 IC3.4 12.4,5.95 R8.1 12.65,4.3 D6.1
AIN_S
  Bottom 0.254: R12.2 16.81,9.55 JP6.1
EXT_VIN  (via drill 0.61)
  Top 0.61: J2.1 10.3,13.5 v7,13.5
  Bottom 0.254: Q1.2 7,16 | 7,16 Q1.7 7,15.35 | Q1.5 7,16 | Q1.6 7,15.35 | Q1.1 7,15.35
  Bottom 0.61: D4.2 v7,13.5 Q1.7
EXT_VIN_BST
  Bottom 0.406: IC2.1 9.6,17.21 10.46,17.21 10.46,17.2 12.4,17.2 12.4,16.5 14.4,16.5 C1.2
EXT_VIN_COMP
  Bottom 0.254: IC2.6 16.6,20.54 C11.1 R2.1
EXT_VIN_COMP_CAP
  Bottom 0.254: R2.2 17.7,18.4 C12.1
EXT_VIN_FB
  Bottom 0.254: R3.1 15,23.2 IC2.5 15,21.6 C2.2 R1.2
EXT_VIN_G
  Bottom 0.254: Q1.3 6.07,17.8 R4.1 6.84,17.8 6.84,21.3 Z1.2
EXT_VIN_INT
  Bottom 0.61: IC2.3 IC2.2 7.6,19.27 Z1.1
  pour Bottom (isolate 0.152, no thermals): 7.2,18.5 8,18.5 8,16.8 10,16.8 10,15.3 8.7,15.3 8.7,16.4 7.7,16.4 7.7,16.6 6.6,16.6 6.6,17 7.2,17
EXT_VIN_OUT  (via drill 0.61)
  Top 0.254: D3.1 30.6,7.1
  Top 0.406: 30.6,7.1 30.5,7.2
  Top 0.61: J6.2 J5.2 J4.2 J3.2 30.5,5.72 30.5,7.2 30.5,9.6 31.76,10.86 31.76,15.64 30.5,16.9 C5.1 29.75,20.3 v31.5,20.3 | v20.2,20.5 15.6,20.5 L1.2
  Bottom 0.254: R1.1 C2.1 19.3,21.4 v20.2,20.5
  Bottom 0.61: D1.2 18.4,7.04 J6.2 | v31.5,20.3 C9.2 C8.2 C7.2 24.9,20.3 24.3,20.9 21.9,20.9 21.5,20.5 v20.2,20.5
EXT_VIN_SS
  Bottom 0.254: C10.1 9.6,22.7 IC2.4
EXT_VIN_SW  (via drill 0.61)
  Top 0.61: L1.1 12.81,18 v13.4,17.41
  Bottom 0.406: C1.1 15.5,18 IC2.8
  Bottom 0.61: IC2.8 14.39,18 13.8,17.4 v13.4,17.4 v13.4,17.41
GND  (via drill 0.25, 0.61)
  Top 0.254: v25.4,11.7 24.5,12.6 C18.1 24.5,16.9 C5.2 | C17.1 27.3,12.6 v28.2,11.7 | C16.1 30.1,12.6 v31,11.7 29.7,10.4 Z3.2 24.4,10.4 | IC4.3 21.25,13.55 24.4,10.4 | 24.4,10.4 23.6,9.6 21.2,9.6 19.4,11.4 D7.2 18,12.2 v18,12.9 | D3.2 v32,5.6 | C14.1 v17.8,17.4 | v11,6.8 12.8,6.8 J2.2 | J1.24 6.1,1.6 v6.1,19.6
  Top 0.61: J2.2 12.8,15.6 v13.6,15.6 | v25,22.1 23.85,20.95 C5.2
  Bottom 0.127: D14.2 25.4,15.7 25.4,13.7 | D12.2 28.1,15.64 28.82,15.64 28.82,14.46 28.2,14.46 28.2,13.7 | D10.2 32.02,15.7 32.02,13.7 31,13.7
  Bottom 0.254: U3.3 28.2,13.7 v28.2,11.7 28.2,10.5 28.38,10.5 28.38,9.2 D13.2 27.6,9 27.6,1.6 | U2.3 31,13.7 v31,11.7 31,10.5 31.18,10.5 31.18,9.2 D11.2 30.6,1.8 30.8,1.6 | U4.3 25.4,13.7 v25.4,11.7 25.4,10.5 25.58,10.5 25.58,9.2 D15.2 25,7.21 25.03,7.17 25.03,1.77 25.2,1.6 | R18.2 D14.2 | R17.2 28.2,15.8 D12.2 | R16.2 31.6,15.8 D10.2 | 18.6,12.9 v18,12.9 18,16.3 | 18.6,12.9 D9.2 | D8.2 21.25,18.7 U1.3 21.25,16.3 C13.1 18,16.3 | v32,5.6 32,1.6 | Z2.2 15.4,1.6 | C15.1 13.7,8.5 13.7,6.6 IC3.2 15.6,6.6 15.6,5.6 D5.2 R9.2 16.4,1.6 | R12.1 18.6,12.9 | 18,16.3 18,17.4 v17.8,17.4 16.6,17.4 C12.2 16.6,19.2 | D2.2 7.2,1.6 | C3.1 8.4,1.5 8.4,1.6 | IC1.2 8,7.9 8,6.1 10.8,6.1 C4.1 | C4.1 10.7,5.9 10.6,5.8 10.6,1.6 | D6.2 13.8,1.6 | C4.1 v11,6.8 | R4.2 v6.1,19.6 6.1,22.7 C10.2 7,23.4 10.8,23.4 R3.2 | C11.2 16.6,19.2 | IC2.7 15,19.2 16.6,19.2
  Bottom 0.61: J1.9 32,1.6 30.8,1.6 J3.1 27.6,1.6 J4.1 25.2,1.6 J5.1 J6.1 16.4,1.6 15.4,1.6 13.8,1.6 10.6,1.6 8.4,1.6 7.2,1.6 J1.24 | D4.1 13.66,15.6 v13.6,15.6 11.65,15.6 C6.2 | IC2.7 12.3,19.27 IC2.9 | C9.1 C8.1 C7.1 v25,22.1
  other vias: 13.2,21.2 13.2,20.4 13.2,19.6 13.2,18.8 12.4,18.8 12.4,19.6 12.4,20.4 12.4,21.2 11.6,21.2 11.6,20.4 11.6,19.6 11.6,18.8 5.6,23.6 32,25.6 5,5.4 5,8 0.6,8 0.6,5.4 6.1,5.6 13.4,5 11.5,8.5 8.2,20.2 18.6,19.4 34.8,10.4 34.8,8 34.8,13
  pour Bottom (isolate 0.152, rank 2): 0.2,0.2 35.4,0.2 35.4,26.6 0.2,26.6
  pour Top (isolate 0.152, rank 2): 0.1,0.1 35.5,0.1 35.5,26.7 0.1,26.7
P6_ADC  (via drill 0.25)
  Top 0.254: v11.2,2.8 11.2,5.5 6.6,10.1 6.6,11.7 v7.5,12.6
  Bottom 0.254: R8.2 11.25,2.85 v11.2,2.8 | v7.5,12.6 v7.51,12.59 JP1.2
P6_ADC_INT
  Bottom 0.254: J1.7 2.9,5.44 2.9,10 3.4,10.5 6.5,10.5 6.69,10.69 JP1.1
P7_PWM
  Bottom 0.254: U2.2 29.6,15.2 29.69,15.29 JP2.2 30.9,15.29 | 30.9,15.29 30.9,17 31.5,17.6 R16.1 | 30.9,15.29 30.9,14.9 D10.1
P7_PWM_INT
  Bottom 0.127: J1.11 32.34,8.34 32.34,16.4 32.34,16.48 32.34,17.86 32.11,18.09 30.59,18.09 30.45,17.95 30.4,17.9 29.9,17.4 JP2.1
P7_PWM_SERVO
  Bottom 0.254: R13.2 29.2,6.96 J3.3
P7_PWM_SERVO_INT
  Bottom 0.254: U2.4 30.25,10.35 D11.1 30.35,10.25 R13.1
P8_PWM
  Bottom 0.254: U3.2 26.9,13.8 26.9,15.29 JP3.2 27.5,15.29 | D12.1 27.5,14.9 27.5,15.29 | R17.1 28.1,17.6 27.5,17 27.5,15.29
P8_PWM_INT
  Bottom 0.127: J1.12 32.59,10.63 32.59,16.4 32.59,16.58 32.59,17.96 32.16,18.4 28,18.4 26.5,16.9 JP3.1
P8_PWM_SERVO
  Bottom 0.254: R14.2 26.4,6.7 J4.3
P8_PWM_SERVO_INT
  Bottom 0.254: U3.4 27.45,10.35 D13.1 27.55,10.25 R14.1
P9_PWM
  Bottom 0.254: U4.2 24,14.8 24,14.9 | 24,14.9 24,15.29 JP4.2 | D14.1 24,14.9 | 24,14.9 24,17 24.6,17.6 R18.1
P9_PWM_INT
  Bottom 0.127: J1.13 32.85,12.91 32.85,18.07 32.22,18.7 24.7,18.7 23.2,17.2 23.2,16.11 JP4.1
P9_PWM_SERVO
  Bottom 0.254: R15.2 23.84,8.31 J5.3
P9_PWM_SERVO_INT
  Bottom 0.254: U4.4 24.65,10.35 D15.1 24.75,10.25 R15.1
P10_FSYNC  (via drill 0.25)
  Top 0.254: IC4.4 21.2,16.4 v21.2,19.6
  Bottom 0.254: R6.2 19.5,17.4 19.5,16.75 20.6,16.75 U1.2 20.6,18.7 D8.1 20.5,19.6 v21.2,19.6 22.49,19.6 JP5.2
P10_FSYNC_INT  (via drill 0.25)
  Top 0.254: v32.4,19.1 32.4,15.9 J1.14
  Bottom 0.254: v32.4,19.1 23.81,19.1 JP5.1
SW
  Bottom 0.254: IC1.1 6.75,5.95 7.55,5.15 L2.2
SYNC
  Bottom 0.254: JP7.2 J6.3
SYNC_IN  (via drill 0.25)
  Top 0.254: R11.2 v21,12
  Bottom 0.254: v21,12 20.49,11.49 JP7.3
SYNC_IN_INT
  Top 0.254: R5.2 19.4,13.5 D7.1 R11.1 20.6,13.3 | 20.6,13.3 IC4.2 | Z3.1 21.9,12.3 20.9,13.3 20.6,13.3
SYNC_OUT
  Bottom 0.254: R10.2 21.95,10.76 JP7.1
SYNC_OUT_INT
  Bottom 0.254: U1.4 21.25,14.7 20.27,13.72 | 20.27,13.72 R10.1 | D9.1 19.23,13.72 20.27,13.72
V_BATT  (via drill 0.25)
  Top 0.254: v26.8,11.7 26.3,12.2 C17.2 | C16.2 29.1,12.2 v29.6,11.7 28.88,11.7 28.4,11.22 28,11.22 27.52,11.7 v26.8,11.7 | v26.8,11.7 26.08,11.7 25.6,11.22 25.2,11.22 24.72,11.7 v24,11.7 23.5,12.2 C18.2 23.6,12.8 23.6,14.6 22.8,15.4 v20.6,15.4 18.7,15.4 R5.1 17.7,15.3 17.4,15 17.4,14.18 15.82,12.6 14.4,12.6 14.1,12.3 v14.1,9.3
  Bottom 0.254: U4.5 v24,11.7 | U3.5 v26.8,11.7 | U2.5 v29.6,11.7 | C13.2 19.95,15.3 U1.5 20.05,15.4 v20.6,15.4 | 12.8,7.7 C15.2 12.8,9 13.1,9.3 v14.1,9.3 | 12.8,7.7 12.8,7.3 IC3.5 | IC1.4 9.65,8.85 10.8,7.7 C4.2 12.8,7.7
VCC  (via drill 0.25)
  Top 0.254: v19.8,19.2 19.95,19.05 IC4.5 C14.2 18,16.4 v17.4,15.8
  Bottom 0.254: R6.1 19.5,19.2 v19.8,19.2 | J1.8 2.9,2.9 5.6,2.9 | 5.6,2.9 7.1,2.9 D2.1 8.5,3 C3.2 8.8,3.1 9.3,3.6 9.3,4.85 L2.1 | v17.4,15.8 17.4,14.2 12.8,9.6 6,9.6 5.6,9.2 5.6,2.9
VIN  (via drill 0.61)
  Bottom 0.61: D1.1 18.85,2.9 v20.1,2.9
  pour Top (isolate 0.152): 19.6,2.4 19.6,3.3 33.2,3.3 33.2,5 34.8,5 34.8,2.4

### Text on the board
tPlace: PWR - 6V to 36V | AIN - 0 to 5V or 4-20mA | P7-P10 - 0 to 5V I/O | OpenMV | Servo / Shield / R2 | PWR | GND | AIN | P10 | P9 | P8 | P7 | PWM | 5V | VIN | GND | GND
bPlace: Servo Shield R2 | https://openmv.io | 4.28.23 | FSYNC / P10 | P9 | P8 | P7 | mA | I | O | ADC / P6 | SYN | VIN | RAW | GND | GND